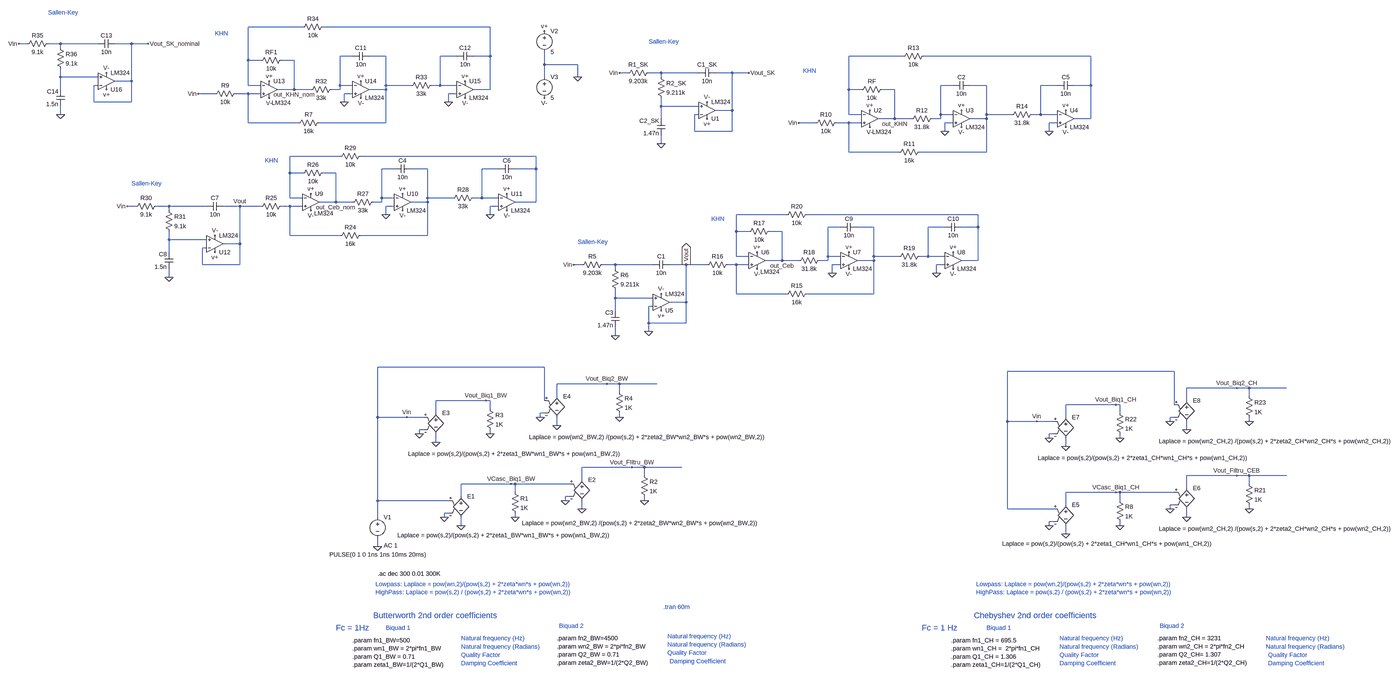
[diagram p0: schematic FitNicolae_Project_Cebyshev.asc, whole sheet]
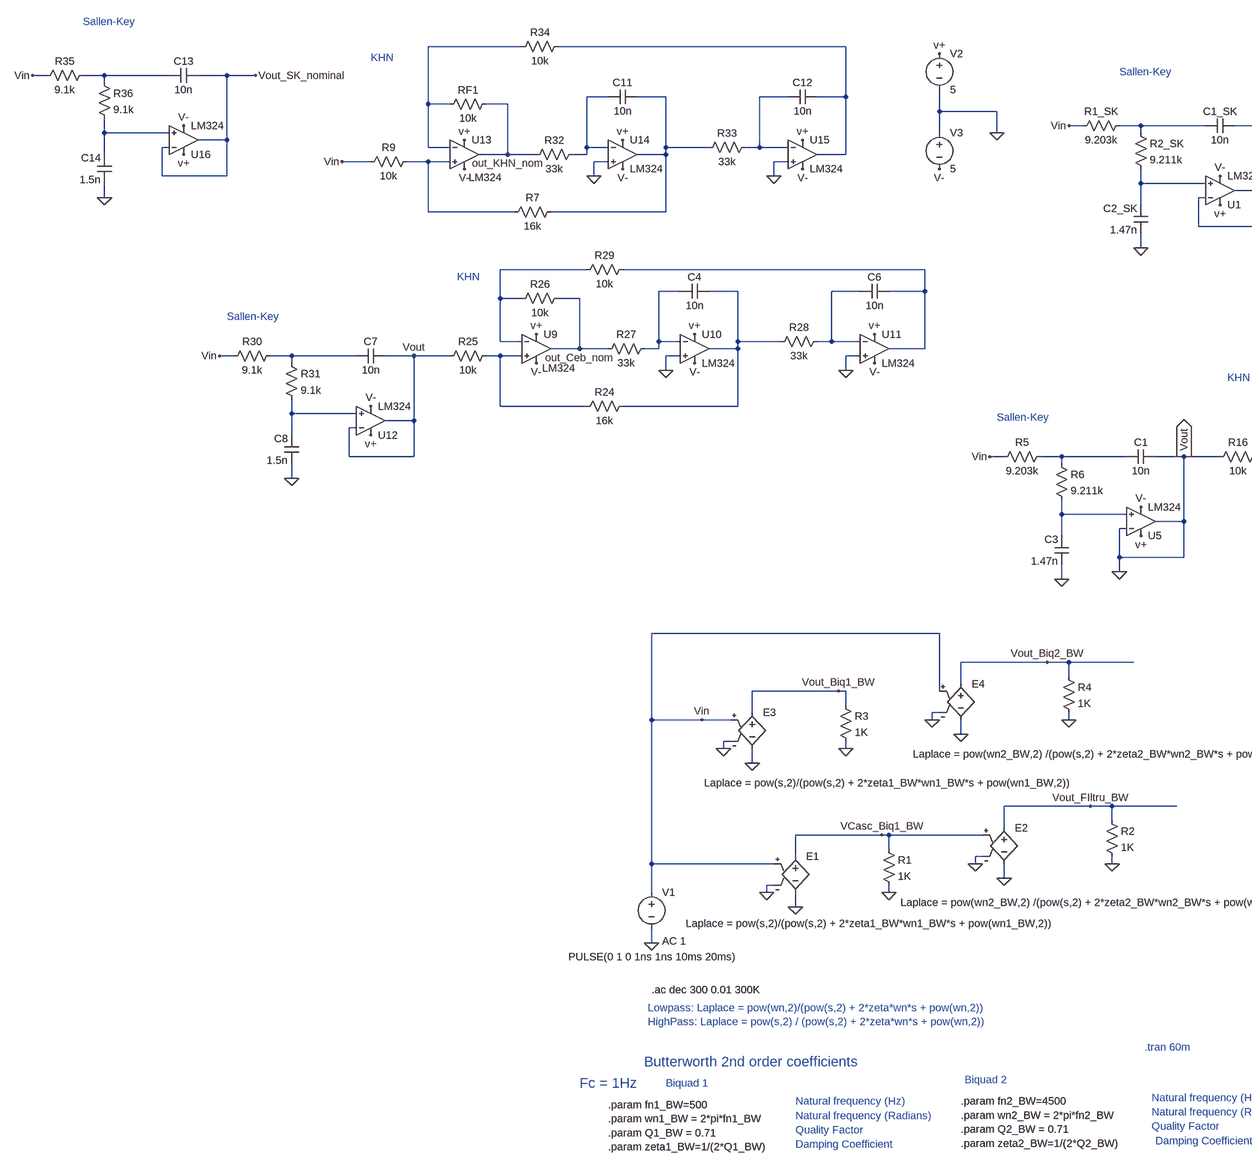
[diagram p1: schematic FitNicolae_Project_Cebyshev.asc, part, row 1 of 1, column 1 of 2]
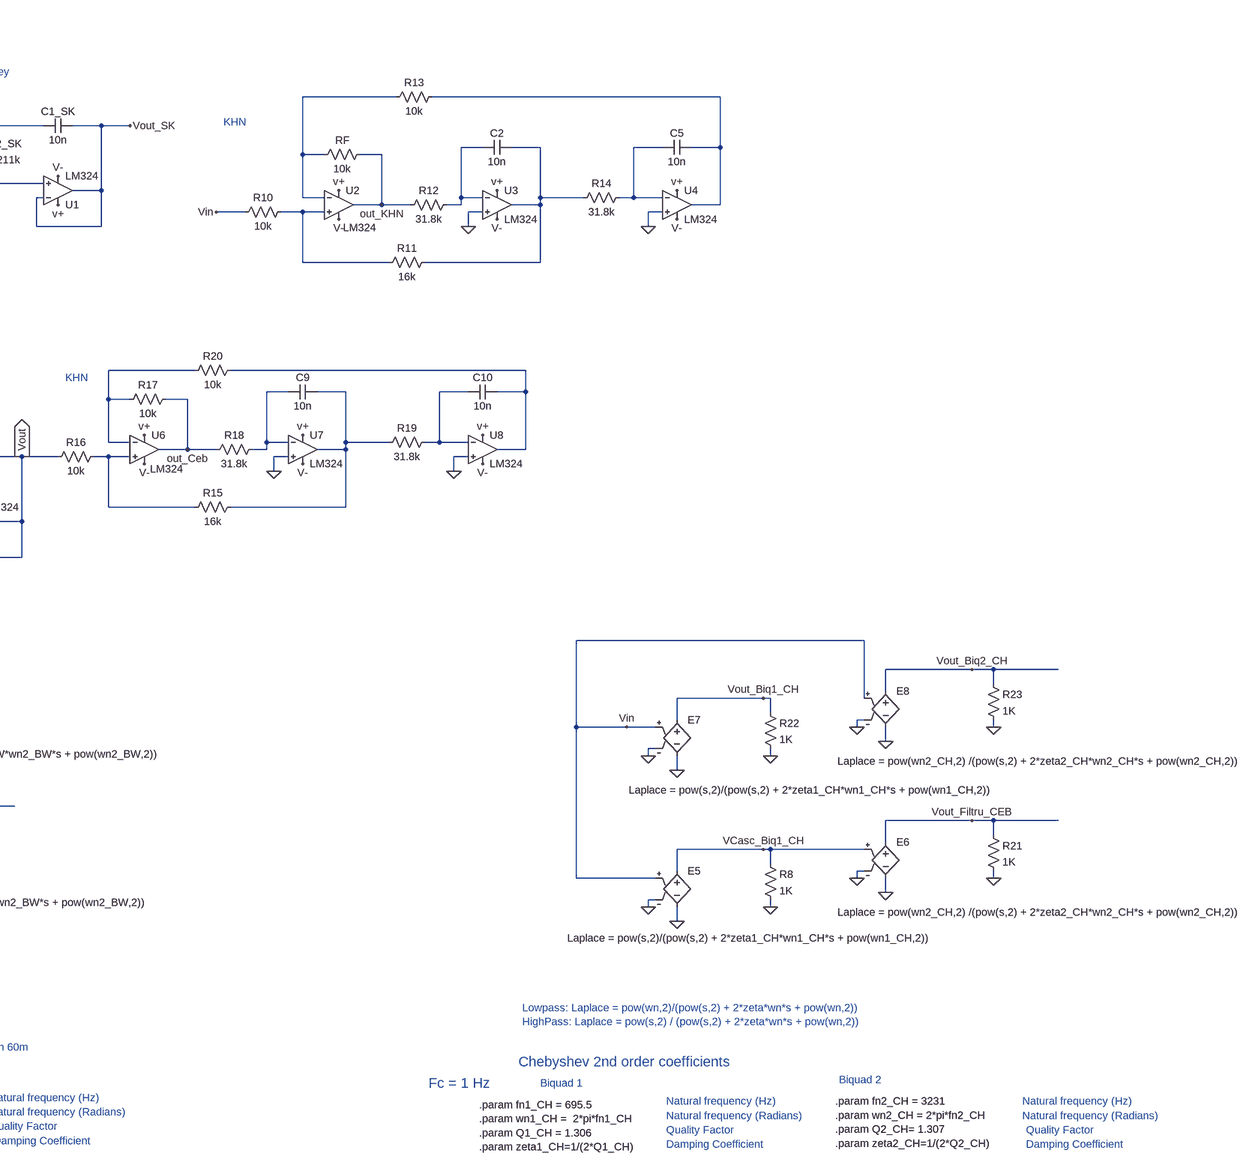
[diagram p2: schematic FitNicolae_Project_Cebyshev.asc, part, row 1 of 1, column 2 of 2]
FitNicolae_Project_Cebyshev.asc, the LTspice schematic file:
Version 4.1
SHEET 1 5900 1108
WIRE -768 -2288 -976 -2288
WIRE -48 -2288 -688 -2288
WIRE -1824 -2224 -1856 -2224
WIRE -1696 -2224 -1744 -2224
WIRE -1552 -2224 -1696 -2224
WIRE -1424 -2224 -1488 -2224
WIRE -1360 -2224 -1424 -2224
WIRE -1696 -2208 -1696 -2224
WIRE -576 -2176 -624 -2176
WIRE -448 -2176 -512 -2176
WIRE -176 -2176 -240 -2176
WIRE -48 -2176 -48 -2288
WIRE -48 -2176 -112 -2176
WIRE 1536 -2176 1328 -2176
WIRE 2256 -2176 1616 -2176
WIRE -976 -2160 -976 -2288
WIRE -928 -2160 -976 -2160
WIRE -800 -2160 -848 -2160
WIRE 160 -2144 160 -2192
WIRE 288 -2144 160 -2144
WIRE 480 -2112 448 -2112
WIRE 608 -2112 560 -2112
WIRE 752 -2112 608 -2112
WIRE 880 -2112 816 -2112
WIRE 944 -2112 880 -2112
WIRE -1696 -2096 -1696 -2128
WIRE -1552 -2096 -1696 -2096
WIRE 160 -2096 160 -2144
WIRE 288 -2096 288 -2144
WIRE 608 -2096 608 -2112
WIRE -1424 -2080 -1424 -2224
WIRE -1424 -2080 -1488 -2080
WIRE -1552 -2064 -1568 -2064
WIRE -976 -2064 -976 -2160
WIRE -928 -2064 -976 -2064
WIRE -624 -2064 -624 -2176
WIRE -576 -2064 -624 -2064
WIRE -448 -2064 -448 -2176
WIRE -352 -2064 -448 -2064
WIRE -240 -2064 -240 -2176
WIRE -240 -2064 -272 -2064
WIRE -176 -2064 -240 -2064
WIRE 1728 -2064 1680 -2064
WIRE 1856 -2064 1792 -2064
WIRE 2128 -2064 2064 -2064
WIRE 2256 -2064 2256 -2176
WIRE 2256 -2064 2192 -2064
WIRE -1696 -2048 -1696 -2096
WIRE -800 -2048 -800 -2160
WIRE -800 -2048 -864 -2048
WIRE -736 -2048 -800 -2048
WIRE -624 -2048 -624 -2064
WIRE -624 -2048 -656 -2048
WIRE -448 -2048 -448 -2064
WIRE -448 -2048 -512 -2048
WIRE -48 -2048 -48 -2176
WIRE -48 -2048 -112 -2048
WIRE 1328 -2048 1328 -2176
WIRE 1376 -2048 1328 -2048
WIRE 1504 -2048 1456 -2048
WIRE -1104 -2032 -1168 -2032
WIRE -976 -2032 -1024 -2032
WIRE -928 -2032 -976 -2032
WIRE -576 -2032 -608 -2032
WIRE -176 -2032 -208 -2032
WIRE -1568 -2000 -1568 -2064
WIRE -1424 -2000 -1424 -2080
WIRE -1424 -2000 -1568 -2000
WIRE -608 -2000 -608 -2032
WIRE -208 -2000 -208 -2032
WIRE 608 -1984 608 -2016
WIRE 752 -1984 608 -1984
WIRE 880 -1968 880 -2112
WIRE 880 -1968 816 -1968
WIRE -1696 -1952 -1696 -1984
WIRE 752 -1952 736 -1952
WIRE 1328 -1952 1328 -2048
WIRE 1376 -1952 1328 -1952
WIRE 1680 -1952 1680 -2064
WIRE 1728 -1952 1680 -1952
WIRE 1856 -1952 1856 -2064
WIRE 1952 -1952 1856 -1952
WIRE 2064 -1952 2064 -2064
WIRE 2064 -1952 2032 -1952
WIRE 2128 -1952 2064 -1952
WIRE 608 -1936 608 -1984
WIRE 1504 -1936 1504 -2048
WIRE 1504 -1936 1440 -1936
WIRE 1568 -1936 1504 -1936
WIRE 1680 -1936 1680 -1952
WIRE 1680 -1936 1648 -1936
WIRE 1856 -1936 1856 -1952
WIRE 1856 -1936 1792 -1936
WIRE 2256 -1936 2256 -2064
WIRE 2256 -1936 2192 -1936
WIRE -976 -1920 -976 -2032
WIRE -784 -1920 -976 -1920
WIRE -448 -1920 -448 -2048
WIRE -448 -1920 -704 -1920
WIRE 1200 -1920 1136 -1920
WIRE 1328 -1920 1280 -1920
WIRE 1376 -1920 1328 -1920
WIRE 1728 -1920 1696 -1920
WIRE 2128 -1920 2096 -1920
WIRE 736 -1888 736 -1952
WIRE 880 -1888 880 -1968
WIRE 880 -1888 736 -1888
WIRE 1696 -1888 1696 -1920
WIRE 2096 -1888 2096 -1920
WIRE 608 -1840 608 -1872
WIRE 1328 -1808 1328 -1920
WIRE 1520 -1808 1328 -1808
WIRE 1856 -1808 1856 -1936
WIRE 1856 -1808 1600 -1808
WIRE -624 -1792 -816 -1792
WIRE 128 -1792 -544 -1792
WIRE -416 -1744 -464 -1744
WIRE -288 -1744 -352 -1744
WIRE -16 -1744 -80 -1744
WIRE 128 -1744 128 -1792
WIRE 128 -1744 48 -1744
WIRE -816 -1728 -816 -1792
WIRE -768 -1728 -816 -1728
WIRE -640 -1728 -688 -1728
WIRE -816 -1632 -816 -1728
WIRE -768 -1632 -816 -1632
WIRE -464 -1632 -464 -1744
WIRE -416 -1632 -464 -1632
WIRE -288 -1632 -288 -1744
WIRE -192 -1632 -288 -1632
WIRE -80 -1632 -80 -1744
WIRE -80 -1632 -112 -1632
WIRE -16 -1632 -80 -1632
WIRE -640 -1616 -640 -1728
WIRE -640 -1616 -704 -1616
WIRE -576 -1616 -640 -1616
WIRE -464 -1616 -464 -1632
WIRE -464 -1616 -496 -1616
WIRE -288 -1616 -288 -1632
WIRE -288 -1616 -352 -1616
WIRE 128 -1616 128 -1744
WIRE 128 -1616 48 -1616
WIRE -1408 -1600 -1440 -1600
WIRE -1280 -1600 -1328 -1600
WIRE -1136 -1600 -1280 -1600
WIRE -1008 -1600 -1072 -1600
WIRE -928 -1600 -1008 -1600
WIRE -816 -1600 -848 -1600
WIRE -768 -1600 -816 -1600
WIRE -416 -1600 -448 -1600
WIRE -16 -1600 -48 -1600
WIRE -1280 -1584 -1280 -1600
WIRE -448 -1568 -448 -1600
WIRE -48 -1568 -48 -1600
WIRE 1088 -1568 896 -1568
WIRE 1824 -1568 1168 -1568
WIRE 1296 -1520 1248 -1520
WIRE 1424 -1520 1360 -1520
WIRE 1696 -1520 1632 -1520
WIRE 1824 -1520 1824 -1568
WIRE 1824 -1520 1760 -1520
WIRE 896 -1504 896 -1568
WIRE 944 -1504 896 -1504
WIRE 1072 -1504 1024 -1504
WIRE -816 -1488 -816 -1600
WIRE -624 -1488 -816 -1488
WIRE -288 -1488 -288 -1616
WIRE -288 -1488 -544 -1488
WIRE -1280 -1472 -1280 -1504
WIRE -1136 -1472 -1280 -1472
WIRE -1008 -1456 -1008 -1600
WIRE -1008 -1456 -1072 -1456
WIRE -1136 -1440 -1152 -1440
WIRE -1280 -1424 -1280 -1472
WIRE 896 -1408 896 -1504
WIRE 944 -1408 896 -1408
WIRE 1248 -1408 1248 -1520
WIRE 1296 -1408 1248 -1408
WIRE 1424 -1408 1424 -1520
WIRE 1520 -1408 1424 -1408
WIRE 1632 -1408 1632 -1520
WIRE 1632 -1408 1600 -1408
WIRE 1696 -1408 1632 -1408
WIRE 1072 -1392 1072 -1504
WIRE 1072 -1392 1008 -1392
WIRE 1136 -1392 1072 -1392
WIRE 1248 -1392 1248 -1408
WIRE 1248 -1392 1216 -1392
WIRE 1424 -1392 1424 -1408
WIRE 1424 -1392 1360 -1392
WIRE 1824 -1392 1824 -1520
WIRE 1824 -1392 1760 -1392
WIRE -1152 -1376 -1152 -1440
WIRE -1008 -1376 -1008 -1456
WIRE -1008 -1376 -1152 -1376
WIRE 304 -1376 272 -1376
WIRE 432 -1376 384 -1376
WIRE 576 -1376 432 -1376
WIRE 704 -1376 640 -1376
WIRE 784 -1376 704 -1376
WIRE 896 -1376 864 -1376
WIRE 944 -1376 896 -1376
WIRE 1296 -1376 1264 -1376
WIRE 1696 -1376 1664 -1376
WIRE 432 -1360 432 -1376
WIRE 1264 -1344 1264 -1376
WIRE 1664 -1344 1664 -1376
WIRE -1280 -1328 -1280 -1360
WIRE 896 -1264 896 -1376
WIRE 1088 -1264 896 -1264
WIRE 1424 -1264 1424 -1392
WIRE 1424 -1264 1168 -1264
WIRE 432 -1248 432 -1280
WIRE 576 -1248 432 -1248
WIRE 704 -1232 704 -1376
WIRE 704 -1232 640 -1232
WIRE 576 -1216 560 -1216
WIRE 432 -1200 432 -1248
WIRE 560 -1152 560 -1216
WIRE 704 -1152 704 -1232
WIRE 704 -1152 560 -1152
WIRE 560 -1120 560 -1152
WIRE 432 -1104 432 -1136
WIRE 160 -496 -480 -496
WIRE 2576 -480 1936 -480
WIRE 400 -432 208 -432
WIRE 448 -432 400 -432
WIRE 592 -432 448 -432
WIRE 2816 -416 2624 -416
WIRE 2864 -416 2816 -416
WIRE 3008 -416 2864 -416
WIRE 448 -400 448 -432
WIRE 208 -384 208 -432
WIRE 2864 -384 2864 -416
WIRE -64 -368 -256 -368
WIRE -48 -368 -64 -368
WIRE 160 -368 160 -496
WIRE 2624 -368 2624 -416
WIRE 2352 -352 2160 -352
WIRE 2368 -352 2352 -352
WIRE 2576 -352 2576 -480
WIRE -48 -336 -48 -368
WIRE -256 -320 -256 -368
WIRE 160 -320 144 -320
WIRE 2368 -320 2368 -352
WIRE -480 -304 -480 -496
WIRE -368 -304 -480 -304
WIRE -304 -304 -368 -304
WIRE 144 -304 144 -320
WIRE 448 -304 448 -320
WIRE 2160 -304 2160 -352
WIRE 2576 -304 2560 -304
WIRE 1936 -288 1936 -480
WIRE 2048 -288 1936 -288
WIRE 2112 -288 2048 -288
WIRE 2560 -288 2560 -304
WIRE 2864 -288 2864 -304
WIRE 208 -272 208 -304
WIRE -304 -256 -320 -256
WIRE 2624 -256 2624 -288
WIRE -320 -240 -320 -256
WIRE -48 -240 -48 -256
WIRE 2112 -240 2096 -240
WIRE 2096 -224 2096 -240
WIRE 2368 -224 2368 -240
WIRE -256 -208 -256 -240
WIRE 2160 -192 2160 -224
WIRE 496 -112 304 -112
WIRE 544 -112 496 -112
WIRE 688 -112 544 -112
WIRE 544 -80 544 -112
WIRE 2816 -80 2624 -80
WIRE 2864 -80 2816 -80
WIRE 3008 -80 2864 -80
WIRE 304 -64 304 -112
WIRE 32 -48 -160 -48
WIRE 48 -48 32 -48
WIRE 256 -48 48 -48
WIRE 2864 -48 2864 -80
WIRE 2624 -32 2624 -80
WIRE 48 -16 48 -48
WIRE 2352 -16 2160 -16
WIRE 2368 -16 2352 -16
WIRE 2576 -16 2368 -16
WIRE -160 0 -160 -48
WIRE 256 0 240 0
WIRE -480 16 -480 -304
WIRE -208 16 -480 16
WIRE 240 16 240 0
WIRE 544 16 544 0
WIRE 2368 16 2368 -16
WIRE 2160 32 2160 -16
WIRE 2576 32 2560 32
WIRE 304 48 304 16
WIRE 1936 48 1936 -288
WIRE 2112 48 1936 48
WIRE 2560 48 2560 32
WIRE 2864 48 2864 32
WIRE -208 64 -224 64
WIRE -480 80 -480 16
WIRE -224 80 -224 64
WIRE 48 80 48 64
WIRE 2624 80 2624 48
WIRE 2112 96 2096 96
WIRE -160 112 -160 80
WIRE 2096 112 2096 96
WIRE 2368 112 2368 96
WIRE 2160 144 2160 112
WIRE -480 192 -480 160
FLAG -480 192 0
FLAG -224 80 0
FLAG -160 112 0
FLAG 32 -48 VCasc_Biq1_BW
FLAG 240 16 0
FLAG 304 48 0
FLAG 496 -112 Vout_FIltru_BW
FLAG 48 80 0
FLAG 544 16 0
FLAG -368 -304 Vin
FLAG -320 -240 0
FLAG -256 -208 0
FLAG -64 -368 Vout_Biq1_BW
FLAG 144 -304 0
FLAG 208 -272 0
FLAG 400 -432 Vout_Biq2_BW
FLAG -48 -240 0
FLAG 448 -304 0
FLAG 160 -2272 v+
FLAG 1696 -1888 0
FLAG 2096 -1888 0
FLAG 1408 -1968 v+
FLAG 1760 -1968 v+
FLAG 2160 -1968 v+
FLAG 1760 -1904 V-
FLAG 2160 -1904 V-
FLAG 1408 -1904 V-
FLAG 1504 -1936 out_KHN
FLAG 1136 -1920 Vin
FLAG 1264 -1344 0
FLAG 1664 -1344 0
FLAG 976 -1424 v+
FLAG 1328 -1424 v+
FLAG 1728 -1424 v+
FLAG 1328 -1360 V-
FLAG 1728 -1360 V-
FLAG 976 -1360 V-
FLAG 1072 -1392 out_Ceb
FLAG 2096 112 0
FLAG 2160 144 0
FLAG 2352 -16 VCasc_Biq1_CH
FLAG 2560 48 0
FLAG 2624 80 0
FLAG 2816 -80 Vout_Filtru_CEB
FLAG 2368 112 0
FLAG 2864 48 0
FLAG 2048 -288 Vin
FLAG 2096 -224 0
FLAG 2160 -192 0
FLAG 2352 -352 Vout_Biq1_CH
FLAG 2560 -288 0
FLAG 2624 -256 0
FLAG 2816 -416 Vout_Biq2_CH
FLAG 2368 -224 0
FLAG 2864 -288 0
FLAG 288 -2096 0
FLAG 160 -2016 V-
FLAG 608 -1840 0
FLAG 944 -2112 Vout_SK
FLAG 448 -2112 Vin
FLAG 432 -1104 0
FLAG 560 -1120 0
FLAG 704 -1376 Vout
IOPIN 704 -1376 Out
FLAG 272 -1376 Vin
FLAG 608 -1200 v+
FLAG 784 -1936 v+
FLAG 784 -2000 V-
FLAG 608 -1264 V-
FLAG -448 -1568 0
FLAG -48 -1568 0
FLAG -736 -1648 v+
FLAG -384 -1648 v+
FLAG 16 -1648 v+
FLAG -384 -1584 V-
FLAG 16 -1584 V-
FLAG -736 -1584 V-
FLAG -640 -1616 out_Ceb_nom
FLAG -1280 -1328 0
FLAG -1008 -1600 Vout
FLAG -1440 -1600 Vin
FLAG -1104 -1424 v+
FLAG -1104 -1488 V-
FLAG -608 -2000 0
FLAG -208 -2000 0
FLAG -896 -2080 v+
FLAG -544 -2080 v+
FLAG -144 -2080 v+
FLAG -544 -2016 V-
FLAG -144 -2016 V-
FLAG -896 -2016 V-
FLAG -800 -2048 out_KHN_nom
FLAG -1168 -2032 Vin
FLAG -1696 -1952 0
FLAG -1360 -2224 Vout_SK_nominal
FLAG -1856 -2224 Vin
FLAG -1520 -2048 v+
FLAG -1520 -2112 V-
SYMBOL voltage -480 64 R0
WINDOW 123 24 124 Left 2
WINDOW 39 0 0 Left 2
WINDOW 3 -185 159 Left 2
SYMATTR Value2 AC 1
SYMATTR Value PULSE(0 1 0 1ns 1ns 10ms 20ms)
SYMATTR InstName V1
SYMBOL e -160 -16 R0
WINDOW 3 -244 165 Left 2
SYMATTR Value Laplace = pow(s,2)/(pow(s,2) + 2*zeta1_BW*wn1_BW*s + pow(wn1_BW,2))
SYMATTR InstName E1
SYMBOL e 304 -80 R0
WINDOW 3 -230 182 Left 2
SYMATTR Value Laplace = pow(wn2_BW,2) /(pow(s,2) + 2*zeta2_BW*wn2_BW*s + pow(wn2_BW,2))
SYMATTR InstName E2
SYMBOL res 32 -32 R0
SYMATTR InstName R1
SYMATTR Value 1K
SYMBOL res 528 -96 R0
SYMATTR InstName R2
SYMATTR Value 1K
SYMBOL e -256 -336 R0
WINDOW 3 -107 172 Left 2
SYMATTR Value Laplace = pow(s,2)/(pow(s,2) + 2*zeta1_BW*wn1_BW*s + pow(wn1_BW,2))
SYMATTR InstName E3
SYMBOL e 208 -400 R0
WINDOW 3 -107 172 Left 2
SYMATTR Value Laplace = pow(wn2_BW,2) /(pow(s,2) + 2*zeta2_BW*wn2_BW*s + pow(wn2_BW,2))
SYMATTR InstName E4
SYMBOL res -64 -352 R0
SYMATTR InstName R3
SYMATTR Value 1K
SYMBOL res 432 -416 R0
SYMATTR InstName R4
SYMATTR Value 1K
SYMBOL voltage 160 -2288 R0
SYMATTR InstName V2
SYMATTR Value 5
SYMBOL voltage 160 -2112 R0
SYMATTR InstName V3
SYMATTR Value 5
SYMBOL res 1616 -1824 R90
WINDOW 0 0 56 VBottom 2
WINDOW 3 32 56 VTop 2
SYMATTR InstName R11
SYMATTR Value 16k
SYMBOL res 1296 -1936 R90
WINDOW 0 0 56 VBottom 2
WINDOW 3 32 56 VTop 2
SYMATTR InstName R10
SYMATTR Value 10k
SYMBOL LM324 1408 -2000 R0
WINDOW 3 10 115 Left 2
SYMATTR InstName U2
SYMBOL LM324 1760 -2000 R0
SYMATTR InstName U3
SYMBOL LM324 2160 -2000 R0
SYMATTR InstName U4
SYMBOL res 1472 -2064 R90
WINDOW 0 0 56 VBottom 2
WINDOW 3 32 56 VTop 2
SYMATTR InstName RF
SYMATTR Value 10k
SYMBOL res 1664 -1952 R90
WINDOW 0 0 56 VBottom 2
WINDOW 3 32 56 VTop 2
SYMATTR InstName R12
SYMATTR Value 31.8k
SYMBOL res 2048 -1968 R90
WINDOW 0 0 56 VBottom 2
WINDOW 3 32 56 VTop 2
SYMATTR InstName R14
SYMATTR Value 31.8k
SYMBOL cap 1792 -2080 R90
WINDOW 0 0 32 VBottom 2
WINDOW 3 32 32 VTop 2
SYMATTR InstName C2
SYMATTR Value 10n
SYMBOL cap 2192 -2080 R90
WINDOW 0 0 32 VBottom 2
WINDOW 3 32 32 VTop 2
SYMATTR InstName C5
SYMATTR Value 10n
SYMBOL res 1632 -2192 R90
WINDOW 0 0 56 VBottom 2
WINDOW 3 32 56 VTop 2
SYMATTR InstName R13
SYMATTR Value 10k
SYMBOL res 1184 -1280 R90
WINDOW 0 0 56 VBottom 2
WINDOW 3 32 56 VTop 2
SYMATTR InstName R15
SYMATTR Value 16k
SYMBOL res 880 -1392 R90
WINDOW 0 0 56 VBottom 2
WINDOW 3 32 56 VTop 2
SYMATTR InstName R16
SYMATTR Value 10k
SYMBOL LM324 976 -1456 R0
WINDOW 3 13 107 Left 2
SYMATTR InstName U6
SYMBOL LM324 1328 -1456 R0
SYMATTR InstName U7
SYMBOL LM324 1728 -1456 R0
SYMATTR InstName U8
SYMBOL res 1040 -1520 R90
WINDOW 0 0 56 VBottom 2
WINDOW 3 32 56 VTop 2
SYMATTR InstName R17
SYMATTR Value 10k
SYMBOL res 1232 -1408 R90
WINDOW 0 0 56 VBottom 2
WINDOW 3 32 56 VTop 2
SYMATTR InstName R18
SYMATTR Value 31.8k
SYMBOL res 1616 -1424 R90
WINDOW 0 0 56 VBottom 2
WINDOW 3 32 56 VTop 2
SYMATTR InstName R19
SYMATTR Value 31.8k
SYMBOL cap 1360 -1536 R90
WINDOW 0 0 32 VBottom 2
WINDOW 3 32 32 VTop 2
SYMATTR InstName C9
SYMATTR Value 10n
SYMBOL cap 1760 -1536 R90
WINDOW 0 0 32 VBottom 2
WINDOW 3 32 32 VTop 2
SYMATTR InstName C10
SYMATTR Value 10n
SYMBOL res 1184 -1584 R90
WINDOW 0 0 56 VBottom 2
WINDOW 3 32 56 VTop 2
SYMATTR InstName R20
SYMATTR Value 10k
SYMBOL e 2160 16 R0
WINDOW 3 -244 165 Left 2
SYMATTR Value Laplace = pow(s,2)/(pow(s,2) + 2*zeta1_CH*wn1_CH*s + pow(wn1_CH,2))
SYMATTR InstName E5
SYMBOL e 2624 -48 R0
WINDOW 3 -107 172 Left 2
SYMATTR Value Laplace = pow(wn2_CH,2) /(pow(s,2) + 2*zeta2_CH*wn2_CH*s + pow(wn2_CH,2))
SYMATTR InstName E6
SYMBOL res 2352 0 R0
SYMATTR InstName R8
SYMATTR Value 1K
SYMBOL res 2848 -64 R0
SYMATTR InstName R21
SYMATTR Value 1K
SYMBOL e 2160 -320 R0
WINDOW 3 -107 172 Left 2
SYMATTR Value Laplace = pow(s,2)/(pow(s,2) + 2*zeta1_CH*wn1_CH*s + pow(wn1_CH,2))
SYMATTR InstName E7
SYMBOL e 2624 -384 R0
WINDOW 3 -107 172 Left 2
SYMATTR Value Laplace = pow(wn2_CH,2) /(pow(s,2) + 2*zeta2_CH*wn2_CH*s + pow(wn2_CH,2))
SYMATTR InstName E8
SYMBOL res 2352 -336 R0
SYMATTR InstName R22
SYMATTR Value 1K
SYMBOL res 2848 -400 R0
SYMATTR InstName R23
SYMATTR Value 1K
SYMBOL cap 816 -2128 R90
WINDOW 0 0 32 VBottom 2
WINDOW 3 32 32 VTop 2
SYMATTR InstName C1_SK
SYMATTR Value 10n
SYMBOL cap 624 -1872 R180
WINDOW 0 24 56 Left 2
WINDOW 3 24 8 Left 2
SYMATTR InstName C2_SK
SYMATTR Value 1.47n
SYMBOL res 576 -2128 R90
WINDOW 0 0 56 VBottom 2
WINDOW 3 32 56 VTop 2
SYMATTR InstName R1_SK
SYMATTR Value 9.203k
SYMBOL res 592 -2112 R0
SYMATTR InstName R2_SK
SYMATTR Value 9.211k
SYMBOL cap 640 -1392 R90
WINDOW 0 0 32 VBottom 2
WINDOW 3 32 32 VTop 2
SYMATTR InstName C1
SYMATTR Value 10n
SYMBOL cap 448 -1136 R180
WINDOW 0 24 56 Left 2
WINDOW 3 24 8 Left 2
SYMATTR InstName C3
SYMATTR Value 1.47n
SYMBOL res 400 -1392 R90
WINDOW 0 0 56 VBottom 2
WINDOW 3 32 56 VTop 2
SYMATTR InstName R5
SYMATTR Value 9.203k
SYMBOL res 416 -1376 R0
SYMATTR InstName R6
SYMATTR Value 9.211k
SYMBOL LM324 784 -1904 M180
SYMATTR InstName U1
SYMBOL LM324 608 -1168 M180
SYMATTR InstName U5
SYMBOL res -528 -1504 R90
WINDOW 0 0 56 VBottom 2
WINDOW 3 32 56 VTop 2
SYMATTR InstName R24
SYMATTR Value 16k
SYMBOL res -832 -1616 R90
WINDOW 0 0 56 VBottom 2
WINDOW 3 32 56 VTop 2
SYMATTR InstName R25
SYMATTR Value 10k
SYMBOL LM324 -736 -1680 R0
WINDOW 3 13 107 Left 2
SYMATTR InstName U9
SYMBOL LM324 -384 -1680 R0
SYMATTR InstName U10
SYMBOL LM324 16 -1680 R0
SYMATTR InstName U11
SYMBOL res -672 -1744 R90
WINDOW 0 0 56 VBottom 2
WINDOW 3 32 56 VTop 2
SYMATTR InstName R26
SYMATTR Value 10k
SYMBOL res -480 -1632 R90
WINDOW 0 0 56 VBottom 2
WINDOW 3 32 56 VTop 2
SYMATTR InstName R27
SYMATTR Value 33k
SYMBOL res -96 -1648 R90
WINDOW 0 0 56 VBottom 2
WINDOW 3 32 56 VTop 2
SYMATTR InstName R28
SYMATTR Value 33k
SYMBOL cap -352 -1760 R90
WINDOW 0 0 32 VBottom 2
WINDOW 3 32 32 VTop 2
SYMATTR InstName C4
SYMATTR Value 10n
SYMBOL cap 48 -1760 R90
WINDOW 0 0 32 VBottom 2
WINDOW 3 32 32 VTop 2
SYMATTR InstName C6
SYMATTR Value 10n
SYMBOL res -528 -1808 R90
WINDOW 0 0 56 VBottom 2
WINDOW 3 32 56 VTop 2
SYMATTR InstName R29
SYMATTR Value 10k
SYMBOL cap -1072 -1616 R90
WINDOW 0 0 32 VBottom 2
WINDOW 3 32 32 VTop 2
SYMATTR InstName C7
SYMATTR Value 10n
SYMBOL cap -1264 -1360 R180
WINDOW 0 24 56 Left 2
WINDOW 3 24 8 Left 2
SYMATTR InstName C8
SYMATTR Value 1.5n
SYMBOL res -1312 -1616 R90
WINDOW 0 0 56 VBottom 2
WINDOW 3 32 56 VTop 2
SYMATTR InstName R30
SYMATTR Value 9.1k
SYMBOL res -1296 -1600 R0
SYMATTR InstName R31
SYMATTR Value 9.1k
SYMBOL LM324 -1104 -1392 M180
SYMATTR InstName U12
SYMBOL res -688 -1936 R90
WINDOW 0 0 56 VBottom 2
WINDOW 3 32 56 VTop 2
SYMATTR InstName R7
SYMATTR Value 16k
SYMBOL res -1008 -2048 R90
WINDOW 0 0 56 VBottom 2
WINDOW 3 32 56 VTop 2
SYMATTR InstName R9
SYMATTR Value 10k
SYMBOL LM324 -896 -2112 R0
WINDOW 3 10 115 Left 2
SYMATTR InstName U13
SYMBOL LM324 -544 -2112 R0
SYMATTR InstName U14
SYMBOL LM324 -144 -2112 R0
SYMATTR InstName U15
SYMBOL res -832 -2176 R90
WINDOW 0 0 56 VBottom 2
WINDOW 3 32 56 VTop 2
SYMATTR InstName RF1
SYMATTR Value 10k
SYMBOL res -640 -2064 R90
WINDOW 0 0 56 VBottom 2
WINDOW 3 32 56 VTop 2
SYMATTR InstName R32
SYMATTR Value 33k
SYMBOL res -256 -2080 R90
WINDOW 0 0 56 VBottom 2
WINDOW 3 32 56 VTop 2
SYMATTR InstName R33
SYMATTR Value 33k
SYMBOL cap -512 -2192 R90
WINDOW 0 0 32 VBottom 2
WINDOW 3 32 32 VTop 2
SYMATTR InstName C11
SYMATTR Value 10n
SYMBOL cap -112 -2192 R90
WINDOW 0 0 32 VBottom 2
WINDOW 3 32 32 VTop 2
SYMATTR InstName C12
SYMATTR Value 10n
SYMBOL res -672 -2304 R90
WINDOW 0 0 56 VBottom 2
WINDOW 3 32 56 VTop 2
SYMATTR InstName R34
SYMATTR Value 10k
SYMBOL cap -1488 -2240 R90
WINDOW 0 0 32 VBottom 2
WINDOW 3 32 32 VTop 2
SYMATTR InstName C13
SYMATTR Value 10n
SYMBOL cap -1680 -1984 R180
WINDOW 0 24 56 Left 2
WINDOW 3 24 8 Left 2
SYMATTR InstName C14
SYMATTR Value 1.5n
SYMBOL res -1728 -2240 R90
WINDOW 0 0 56 VBottom 2
WINDOW 3 32 56 VTop 2
SYMATTR InstName R35
SYMATTR Value 9.1k
SYMBOL res -1712 -2224 R0
SYMATTR InstName R36
SYMATTR Value 9.1k
SYMBOL LM324 -1520 -2016 M180
SYMATTR InstName U16
TEXT -576 552 Left 2 !.param fn1_BW=500\n.param wn1_BW = 2*pi*fn1_BW\n.param Q1_BW = 0.71\n.param zeta1_BW=1/(2*Q1_BW)
TEXT -480 296 Left 2 !.ac dec 300 0.01 300K
TEXT -160 544 Left 2 ;Natural frequency (Hz)
TEXT -160 576 Left 2 ;Natural frequency (Radians)
TEXT -160 640 Left 2 ;Damping Coefficient
TEXT -448 504 Left 2 ;Biquad 1
TEXT -488 336 Left 2 ;Lowpass: Laplace = pow(wn,2)/(pow(s,2) + 2*zeta*wn*s + pow(wn,2))\nHighPass: Laplace = pow(s,2) / (pow(s,2) + 2*zeta*wn*s + pow(wn,2))
TEXT 208 544 Left 2 !.param fn2_BW=4500\n.param wn2_BW = 2*pi*fn2_BW\n.param Q2_BW = 0.71\n.param zeta2_BW=1/(2*Q2_BW)
TEXT 632 536 Left 2 ;Natural frequency (Hz)
TEXT 632 568 Left 2 ;Natural frequency (Radians)
TEXT 640 632 Left 2 ;Damping Coefficient
TEXT -160 608 Left 2 ;Quality Factor
TEXT 632 600 Left 2 ;Quality Factor
TEXT -496 456 Left 3 ;Butterworth 2nd order coefficients
TEXT 216 496 Left 2 ;Biquad 2
TEXT 1720 552 Left 2 !.param fn1_CH = 695.5\n.param wn1_CH =  2*pi*fn1_CH\n.param Q1_CH = 1.306\n.param zeta1_CH=1/(2*Q1_CH)
TEXT 2136 544 Left 2 ;Natural frequency (Hz)
TEXT 2136 576 Left 2 ;Natural frequency (Radians)
TEXT 2136 640 Left 2 ;Damping Coefficient
TEXT 1856 504 Left 2 ;Biquad 1
TEXT 1816 336 Left 2 ;Lowpass: Laplace = pow(wn,2)/(pow(s,2) + 2*zeta*wn*s + pow(wn,2))\nHighPass: Laplace = pow(s,2) / (pow(s,2) + 2*zeta*wn*s + pow(wn,2))
TEXT 2512 544 Left 2 !.param fn2_CH = 3231\n.param wn2_CH = 2*pi*fn2_CH\n.param Q2_CH= 1.307\n.param zeta2_CH=1/(2*Q2_CH)
TEXT 2928 544 Left 2 ;Natural frequency (Hz)
TEXT 2928 576 Left 2 ;Natural frequency (Radians)
TEXT 2936 640 Left 2 ;Damping Coefficient
TEXT 2136 608 Left 2 ;Quality Factor
TEXT 2936 608 Left 2 ;Quality Factor
TEXT 1808 456 Left 3 ;Chebyshev 2nd order coefficients
TEXT 2520 496 Left 2 ;Biquad 2
TEXT 1608 504 Left 3 ;Fc = 1 Hz
TEXT -640 504 Left 3 ;Fc = 1Hz
TEXT 560 -2232 Left 2 ;Sallen-Key
TEXT 1152 -2120 Left 2 ;KHN
TEXT 288 -1464 Left 2 ;Sallen-Key
TEXT 800 -1552 Left 2 ;KHN
TEXT -1424 -1688 Left 2 ;Sallen-Key
TEXT -912 -1776 Left 2 ;KHN
TEXT -1744 -2344 Left 2 ;Sallen-Key
TEXT -1104 -2264 Left 2 ;KHN
TEXT 616 424 Left 2 ;.tran 60m

The netlist it stands for:
* FitNicolae_Project_Cebyshev.asc
V1 Vin 0 PULSE(0 1 0 1ns 1ns 10ms 20ms) AC 1
E1 VCasc_Biq1_BW 0 Vin 0 Laplace = pow(s,2)/(pow(s,2) + 2*zeta1_BW*wn1_BW*s + pow(wn1_BW,2))
E2 Vout_FIltru_BW 0 VCasc_Biq1_BW 0 Laplace = pow(wn2_BW,2) /(pow(s,2) + 2*zeta2_BW*wn2_BW*s + pow(wn2_BW,2))
R1 VCasc_Biq1_BW 0 1K
R2 Vout_FIltru_BW 0 1K
E3 Vout_Biq1_BW 0 Vin 0 Laplace = pow(s,2)/(pow(s,2) + 2*zeta1_BW*wn1_BW*s + pow(wn1_BW,2))
E4 Vout_Biq2_BW 0 Vin 0 Laplace = pow(wn2_BW,2) /(pow(s,2) + 2*zeta2_BW*wn2_BW*s + pow(wn2_BW,2))
R3 Vout_Biq1_BW 0 1K
R4 Vout_Biq2_BW 0 1K
V2 v+ 0 5
V3 0 V- 5
R11 N012 N016 16k
R10 N016 Vin 10k
* U2: LM324 (symbol LM324 not available, pins judged from their places): In+=N016 In-=N007 V+=v+ V-=V- OUT=out_KHN
* U3: LM324 (symbol LM324 not available, pins judged from their places): In+=0 In-=N011 V+=v+ V-=V- OUT=N012
* U4: LM324 (symbol LM324 not available, pins judged from their places): In+=0 In-=N013 V+=v+ V-=V- OUT=N008
RF out_KHN N007 10k
R12 N011 out_KHN 31.8k
R14 N013 N012 31.8k
C2 N012 N011 10n
C5 N008 N013 10n
R13 N008 N007 10k
R15 N027 N031 16k
R16 N031 0 10k
* U6: LM324 (symbol LM324 not available, pins judged from their places): In+=N031 In-=N024 V+=v+ V-=V- OUT=out_Ceb
* U7: LM324 (symbol LM324 not available, pins judged from their places): In+=0 In-=N026 V+=v+ V-=V- OUT=N027
* U8: LM324 (symbol LM324 not available, pins judged from their places): In+=0 In-=N028 V+=v+ V-=V- OUT=N025
R17 out_Ceb N024 10k
R18 N026 out_Ceb 31.8k
R19 N028 N027 31.8k
C9 N027 N026 10n
C10 N025 N028 10n
R20 N025 N024 10k
E5 VCasc_Biq1_CH 0 Vin 0 Laplace = pow(s,2)/(pow(s,2) + 2*zeta1_CH*wn1_CH*s + pow(wn1_CH,2))
E6 Vout_Filtru_CEB 0 VCasc_Biq1_CH 0 Laplace = pow(wn2_CH,2) /(pow(s,2) + 2*zeta2_CH*wn2_CH*s + pow(wn2_CH,2))
R8 VCasc_Biq1_CH 0 1K
R21 Vout_Filtru_CEB 0 1K
E7 Vout_Biq1_CH 0 Vin 0 Laplace = pow(s,2)/(pow(s,2) + 2*zeta1_CH*wn1_CH*s + pow(wn1_CH,2))
E8 Vout_Biq2_CH 0 Vin 0 Laplace = pow(wn2_CH,2) /(pow(s,2) + 2*zeta2_CH*wn2_CH*s + pow(wn2_CH,2))
R22 Vout_Biq1_CH 0 1K
R23 Vout_Biq2_CH 0 1K
C1_SK Vout_SK N009 10n
C2_SK 0 N015 1.47n
R1_SK N009 Vin 9.203k
R2_SK N009 N015 9.211k
C1 0 N030 10n
C3 0 N032 1.47n
R5 N030 Vin 9.203k
R6 N030 N032 9.211k
* U1: LM324 (symbol LM324 not available, pins judged from their places): In+=N015 In-=Vout_SK V+=v+ V-=V- OUT=Vout_SK
* U5: LM324 (symbol LM324 not available, pins judged from their places): In+=N032 In-=0 V+=v+ V-=V- OUT=0
R24 N020 N023 16k
R25 N023 0 10k
* U9: LM324 (symbol LM324 not available, pins judged from their places): In+=N023 In-=N017 V+=v+ V-=V- OUT=out_Ceb_nom
* U10: LM324 (symbol LM324 not available, pins judged from their places): In+=0 In-=N019 V+=v+ V-=V- OUT=N020
* U11: LM324 (symbol LM324 not available, pins judged from their places): In+=0 In-=N021 V+=v+ V-=V- OUT=N018
R26 out_Ceb_nom N017 10k
R27 N019 out_Ceb_nom 33k
R28 N021 N020 33k
C4 N020 N019 10n
C6 N018 N021 10n
R29 N018 N017 10k
C7 0 N022 10n
C8 0 N029 1.5n
R30 N022 Vin 9.1k
R31 N022 N029 9.1k
* U12: LM324 (symbol LM324 not available, pins judged from their places): In+=N029 In-=0 V+=v+ V-=V- OUT=0
R7 N005 N014 16k
R9 N014 Vin 10k
* U13: LM324 (symbol LM324 not available, pins judged from their places): In+=N014 In-=N001 V+=v+ V-=V- OUT=out_KHN_nom
* U14: LM324 (symbol LM324 not available, pins judged from their places): In+=0 In-=N004 V+=v+ V-=V- OUT=N005
* U15: LM324 (symbol LM324 not available, pins judged from their places): In+=0 In-=N006 V+=v+ V-=V- OUT=N002
RF1 out_KHN_nom N001 10k
R32 N004 out_KHN_nom 33k
R33 N006 N005 33k
C11 N005 N004 10n
C12 N002 N006 10n
R34 N002 N001 10k
C13 Vout_SK_nominal N003 10n
C14 0 N010 1.5n
R35 N003 Vin 9.1k
R36 N003 N010 9.1k
* U16: LM324 (symbol LM324 not available, pins judged from their places): In+=N010 In-=Vout_SK_nominal V+=v+ V-=V- OUT=Vout_SK_nominal
.param fn1_BW=500
.param wn1_BW = 2*pi*fn1_BW
.param Q1_BW = 0.71
.param zeta1_BW=1/(2*Q1_BW)
.ac dec 300 0.01 300K
* Natural frequency (Hz)
* Natural frequency (Radians)
* Damping Coefficient
* Biquad 1
* Lowpass: Laplace = pow(wn,2)/(pow(s,2) + 2*zeta*wn*s + pow(wn,2))
* HighPass: Laplace = pow(s,2) / (pow(s,2) + 2*zeta*wn*s + pow(wn,2))
.param fn2_BW=4500
.param wn2_BW = 2*pi*fn2_BW
.param Q2_BW = 0.71
.param zeta2_BW=1/(2*Q2_BW)
* Natural frequency (Hz)
* Natural frequency (Radians)
* Damping Coefficient
* Quality Factor
* Quality Factor
* Butterworth 2nd order coefficients
* Biquad 2
.param fn1_CH = 695.5
.param wn1_CH =  2*pi*fn1_CH
.param Q1_CH = 1.306
.param zeta1_CH=1/(2*Q1_CH)
* Natural frequency (Hz)
* Natural frequency (Radians)
* Damping Coefficient
* Biquad 1
* Lowpass: Laplace = pow(wn,2)/(pow(s,2) + 2*zeta*wn*s + pow(wn,2))
* HighPass: Laplace = pow(s,2) / (pow(s,2) + 2*zeta*wn*s + pow(wn,2))
.param fn2_CH = 3231
.param wn2_CH = 2*pi*fn2_CH
.param Q2_CH= 1.307
.param zeta2_CH=1/(2*Q2_CH)
* Natural frequency (Hz)
* Natural frequency (Radians)
* Damping Coefficient
* Quality Factor
* Quality Factor
* Chebyshev 2nd order coefficients
* Biquad 2
* Fc = 1 Hz
* Fc = 1Hz
* Sallen-Key
* KHN
* Sallen-Key
* KHN
* Sallen-Key
* KHN
* Sallen-Key
* KHN
* .tran 60m
.backanno
.end